# EAGLE design Solar Charge Controller (EAGLE 9.6.2)
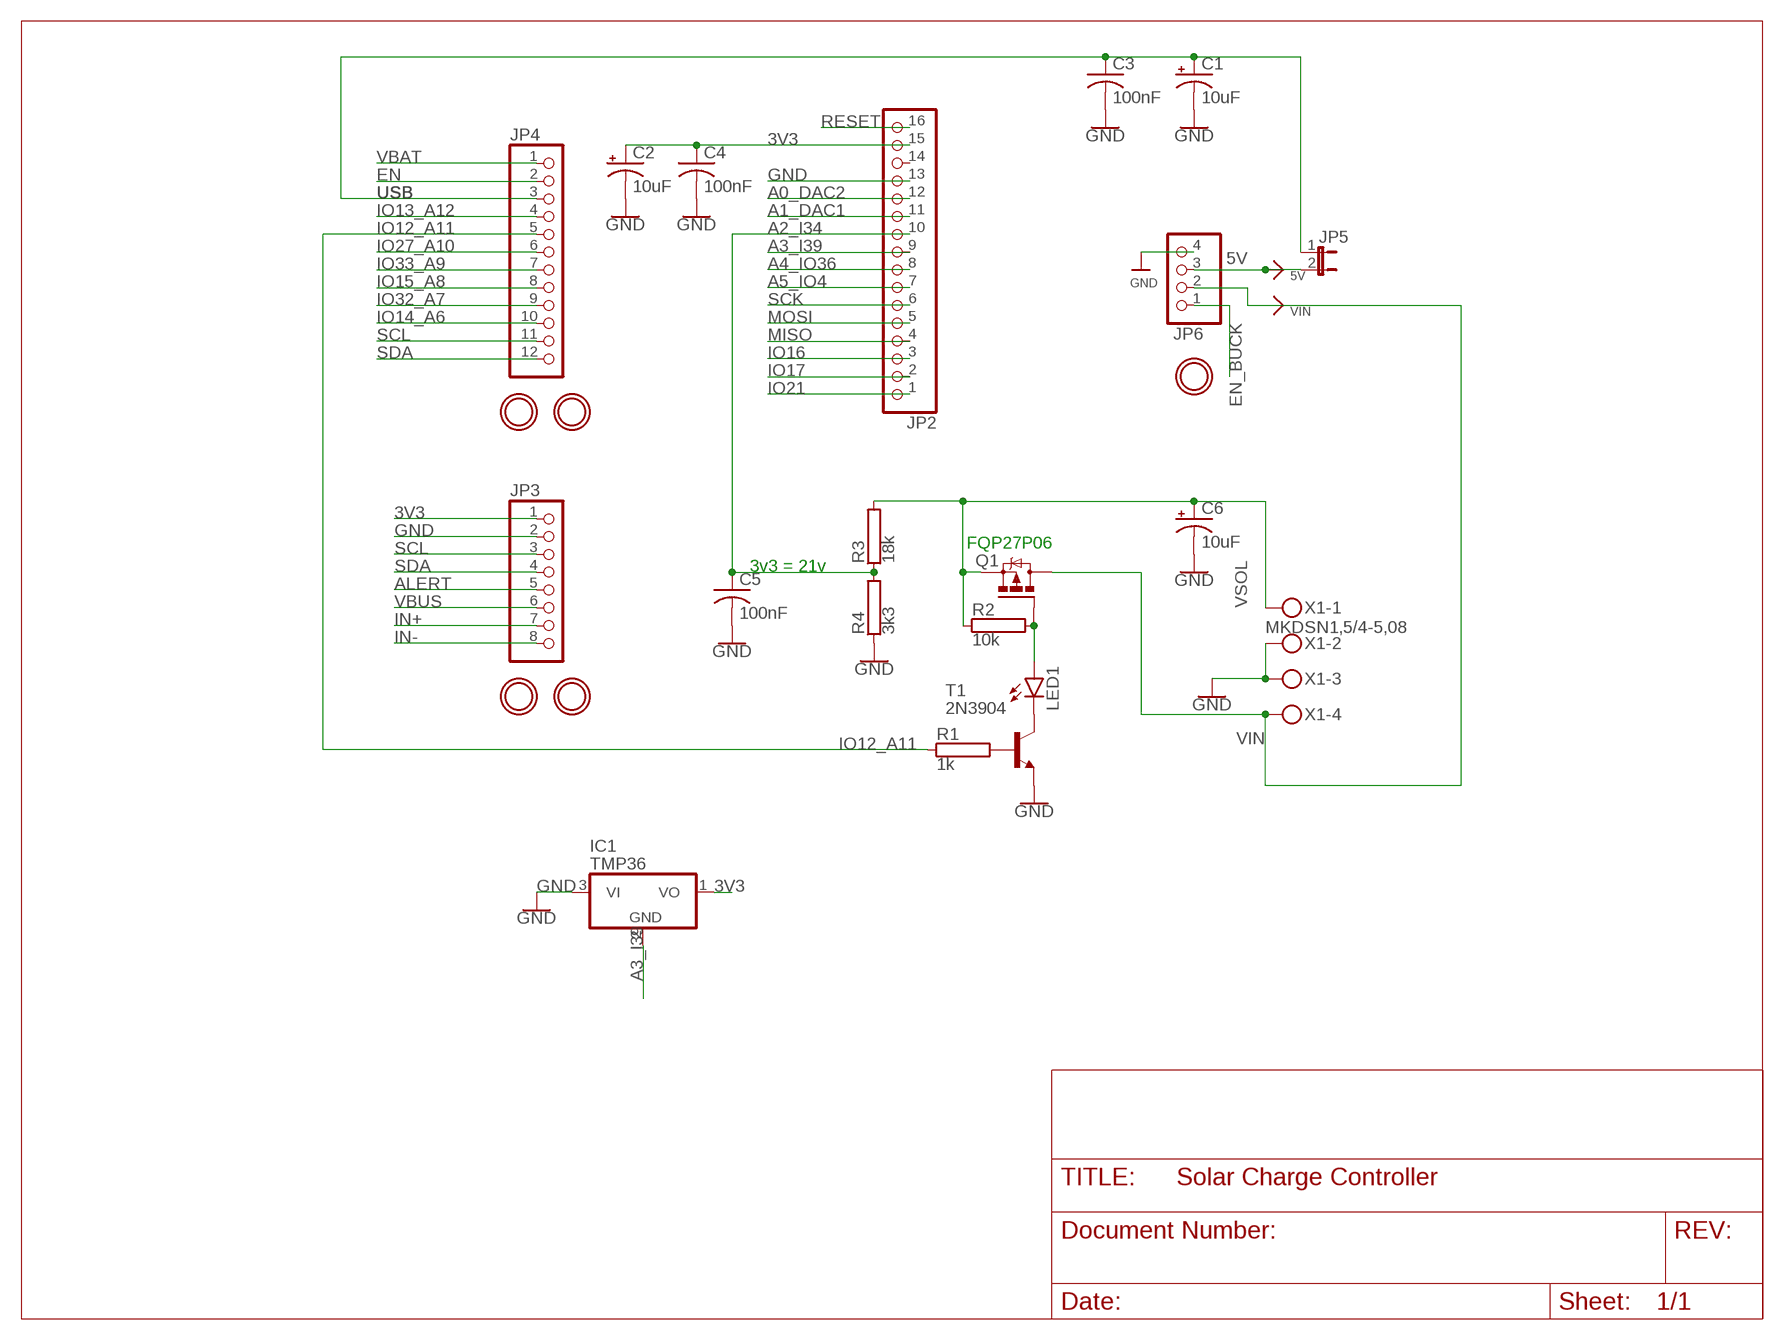
[diagram p0: schematic, sheet 1]

## Parts
C1  10uF  CPOL-USE2.5-5  [E2,5-5]
C2  10uF  CPOL-USE2.5-5  [E2,5-5]
C3  100nF  C-US025-024X044  [C025-024X044]
C4  100nF  C-US025-024X044  [C025-024X044]
C5  100nF  C-US025-024X044  [C025-024X044]
C6  10uF  CPOL-USE2.5-5  [E2,5-5]
IC1  TMP36  78L05Z  [TO92]
JP2  HEADER-1X16_MIN  [1X16_ROUND_MIN]
JP3  HEADER-1X870MIL  [1X08_ROUND_70]
JP4  HEADER-1X12_MIN  [1X12_ROUND_MIN]
JP5  JP1E  [JP1]
JP6  HEADER-1X4ROUND  [1X04_ROUND]
LED1  LED3MM  [LED3MM]
Q1  FQP27P06  IRF9530  [TO220BV]
R1  1k  RRS1/4  [RS1/4]
R2  10k  RRS1/4  [RS1/4]
R3  18k  RRS1/4  [RS1/4]
R4  3k3  RRS1/4  [RS1/4]
T1  2N3904  [TO92]
U$2  MOUNTINGHOLE2.5  [MOUNTINGHOLE_2.5_PLATED]
U$3  MOUNTINGHOLE2.5  [MOUNTINGHOLE_2.5_PLATED]
U$4  MOUNTINGHOLE2.5  [MOUNTINGHOLE_2.5_PLATED]
U$5  MOUNTINGHOLE2.5  [MOUNTINGHOLE_2.5_PLATED]
U$12  MOUNTINGHOLE2.5  [MOUNTINGHOLE_2.5_PLATED]
X1  MKDSN1,5/4-5,08  [MKDSN1,5/4-5,08]

## Nets
3V3: C2.+ C4.1 IC1.1(VO) JP2.15 JP3.1
5V: JP5.2 JP6.3
A0_DAC2: JP2.12
A1_DAC1: JP2.11
A2_I34: C5.1 JP2.10 R3.1 R4.2
A3_I39: IC1.2(GND) JP2.9
A4_IO36: JP2.8
A5_IO4: JP2.7
ALERT: JP3.5
EN: JP4.2
EN_BUCK: JP6.1
GND: C1.- C2.- C3.2 C4.2 C5.2 C6.- IC1.3(VI) JP2.13 JP3.2 JP6.4 R4.1 T1.3(E) X1.2 X1.3
IN+: JP3.7
IN-: JP3.8
IO12_A11: JP4.5 R1.1
IO13_A12: JP4.4
IO14_A6: JP4.10
IO15_A8: JP4.8
IO16: JP2.3
IO17: JP2.2
IO21: JP2.1
IO27_A10: JP4.6
IO32_A7: JP4.9
IO33_A9: JP4.7
MISO: JP2.4
MOSI: JP2.5
N$2: LED1.A Q1.G R2.2
N$3: LED1.K(C) T1.1(C)
N$4: R1.2 T1.2(B)
RESET: JP2.16
SCK: JP2.6
SCL: JP3.3 JP4.11
SDA: JP3.4 JP4.12
USB: C1.+ C3.1 JP4.3 JP5.1
VBAT: JP4.1
VBUS: JP3.6
VIN: JP6.2 Q1.D X1.4
VSOL: C6.+ Q1.S R2.1 R3.2 X1.1
Unconnected: JP2.14

## Notes on the sheet
- 3v3 = 21v

## Library data of the parts
C1 C2 C6 = rcl:CPOL-US: POLARIZED CAPACITOR, American symbol; SPICEPREFIX: C
C3-C5 = rcl:C-US: CAPACITOR, American symbol; SPICEPREFIX: C
IC1 = adafruit:78*: Positive VOLTAGE REGULATOR Added bigger pads to the TO-92 package
JP2 = microbuilder:HEADER-1X16: PIN HEADER
JP3 = microbuilder:HEADER-1X8: PIN HEADER
JP4 = microbuilder:HEADER-1X12
JP5 = jumper:JP1E: JUMPER
JP6 = microbuilder:HEADER-1X4: PIN HEADER
LED1 = led:LED: LED OSRAM: - CHIPLED LG R971, LG N971, LY N971, LG Q971, LY Q971, LO R971, LY R971 LH N974, LH R974 LS Q976, LO Q976, LY Q976 LO Q996 - Hyper CHIPLED LW Q18S LB Q993, LB Q99A, LB R99A - SideLED LS A670, LO A670, LY A670, LG A670, LP A670 LB A673, LV A673, LT A673, LW A673 LH A674 LY A675 LS A676, LA A676, LO A676, LY A676, LW A676 LS A679, LY A679, LG A679 - Hyper Micro SIDELED® LS Y876, LA Y876, LO Y876, LY Y876 LT Y87S - SmartLED LW L88C, LW L88S LB L89C, LB L89S, LG L890 LS L89K, LO L89K, LY L89K LS L896, LA L896, LO L896, LY L896 - TOPLED LS T670, LO T670, LY T670, LG T670, LP T670 LSG T670, LSP T670, LSY T670, LOP T670, LYG T670 LG T671, LOG T671, LSG T671 LB T673, LV T673, LT T673, LW T673 LH T674 LS T676, LA T676, LO T676, LY T676, LB T676, LH T676, LSB T676, LW T676 LB T67C, LV T67C, LT T67C, LS T67K, LO T67K, LY T67K, LW E67C LS E67B, LA E67B, LO E67B, LY E67B, LB E67C, LV E67C, LT E67C LW T67C LS T679, LY T679, LG T679 LS T770, LO T770, LY T770, LG T770, LP T770 LB T773, LV T773, LT T773, LW T773 LH T774 LS E675, LA E675, LY E675, LS T675 LS T776, LA T776, LO T776, LY T776, LB T776 LHGB T686 LT T68C, LB T68C - Hyper Mini TOPLED® LB M676 - Mini TOPLED Santana® LG M470 LS M47K, LO M47K, LY M47K Source: http://www.osram.convergy.de LUXEON: - LUMILED® LXK2-PW12-R00, LXK2-PW12-S00, LXK2-PW14-U00, LXK2-PW14-V00 LXK2-PM12-R00, LXK2-PM12-S00, LXK2-PM14-U00 LXK2-PE12-Q00, LXK2-PE12-R00, LXK2-PE12-S00, LXK2-PE14-T00, LXK2-PE14-U00 LXK2-PB12-K00, LXK2-PB12-L00, LXK2-PB12-M00, LXK2-PB14-N00, LXK2-PB14-P00, LXK2-PB14-Q00 LXK2-PR12-L00, LXK2-PR12-M00, LXK2-PR14-Q00, LXK2-PR14-R00 LXK2-PD12-Q00, LXK2-PD12-R00, LXK2-PD12-S00 LXK2-PH12-R00, LXK2-PH12-S00 LXK2-PL12-P00, LXK2-PL12-Q00, LXK2-PL12-R00 Source: www.luxeon.com KINGBRIGHT: KA-3528ASYC Source: www.kingbright.com
Q1 = transistor-power:IRF9530: P-CHANNEL HEXFET POWER-MOS-FET Source: http://www.irf.com/product-info/datasheets/data/irf9530.pdf
R1-R4 = resistor-power:R: Power Resitor; MF: OHMITE; MPN: RRS1K0; OC_FARNELL: unknown; OC_NEWARK: 01F7661
T1 = transistor:2N3904: NPN TRANSISTOR
U$2-U$5 U$12 = microbuilder:MOUNTINGHOLE: Mounting Hole For #2 screws (0.086"/2.18mm width, 0.094"/2.4mm hole) use 2.5mm; BOM: EXCLUDE
X1 = con-phoenix-508:MKDSN1,5/4-5,08: MKDSN 1,5/ 4-5,08 Printklemme Nennstrom: 13,5 A Nennspannung: 250 V Rastermaß: 5,08 mm Polzahl: 4 Anschlussart: Schraubanschluss Montage: Löten Anschlussrichtung Leiter/Platine: 0 ° Artikelnummer: 1729144 Source: http://eshop.phoenixcontact.com .. 1729144.pdf

## Board
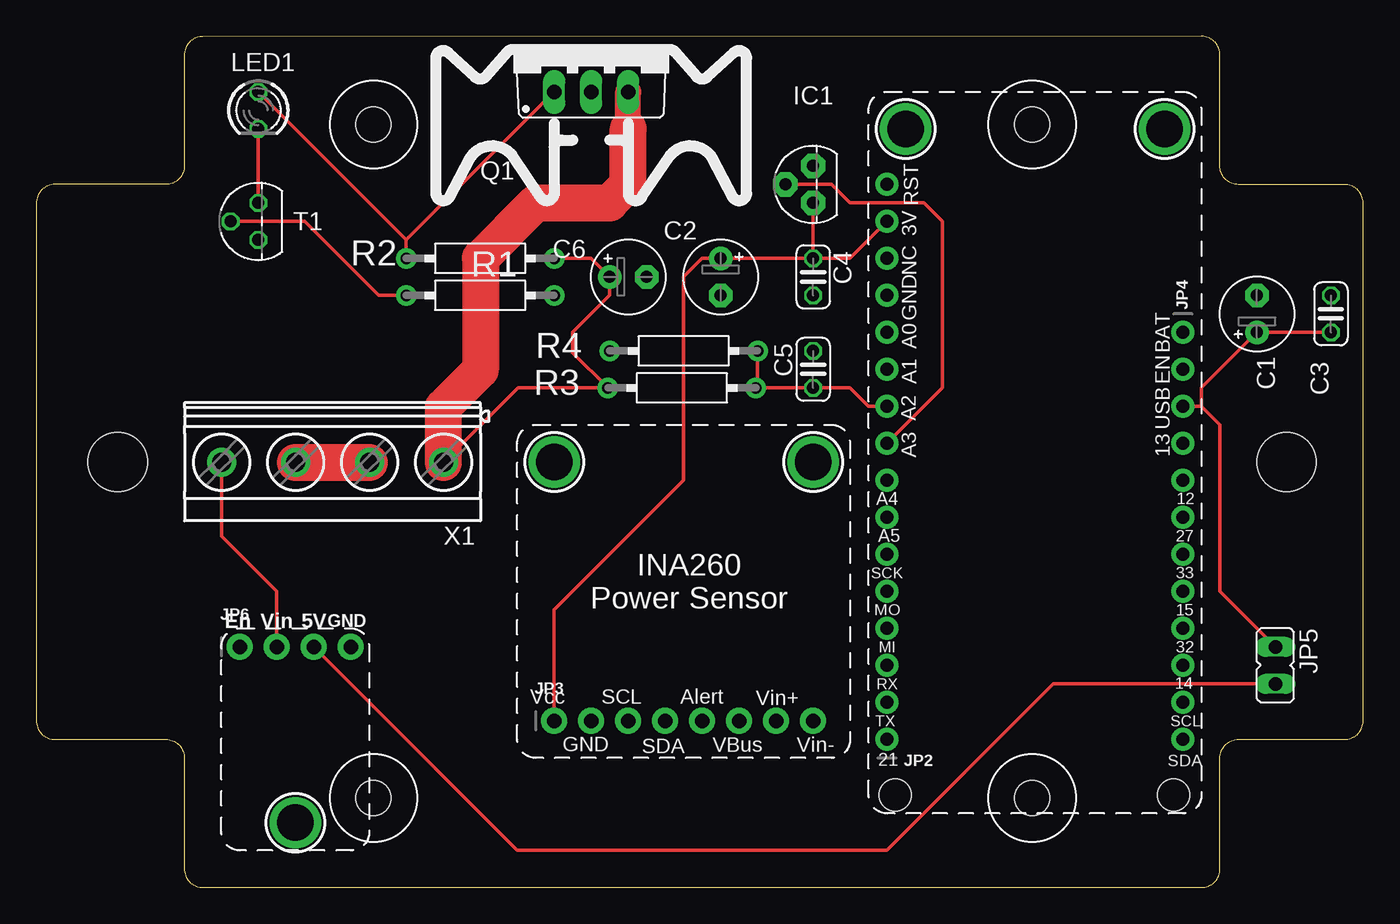
[diagram p1: board, top side]
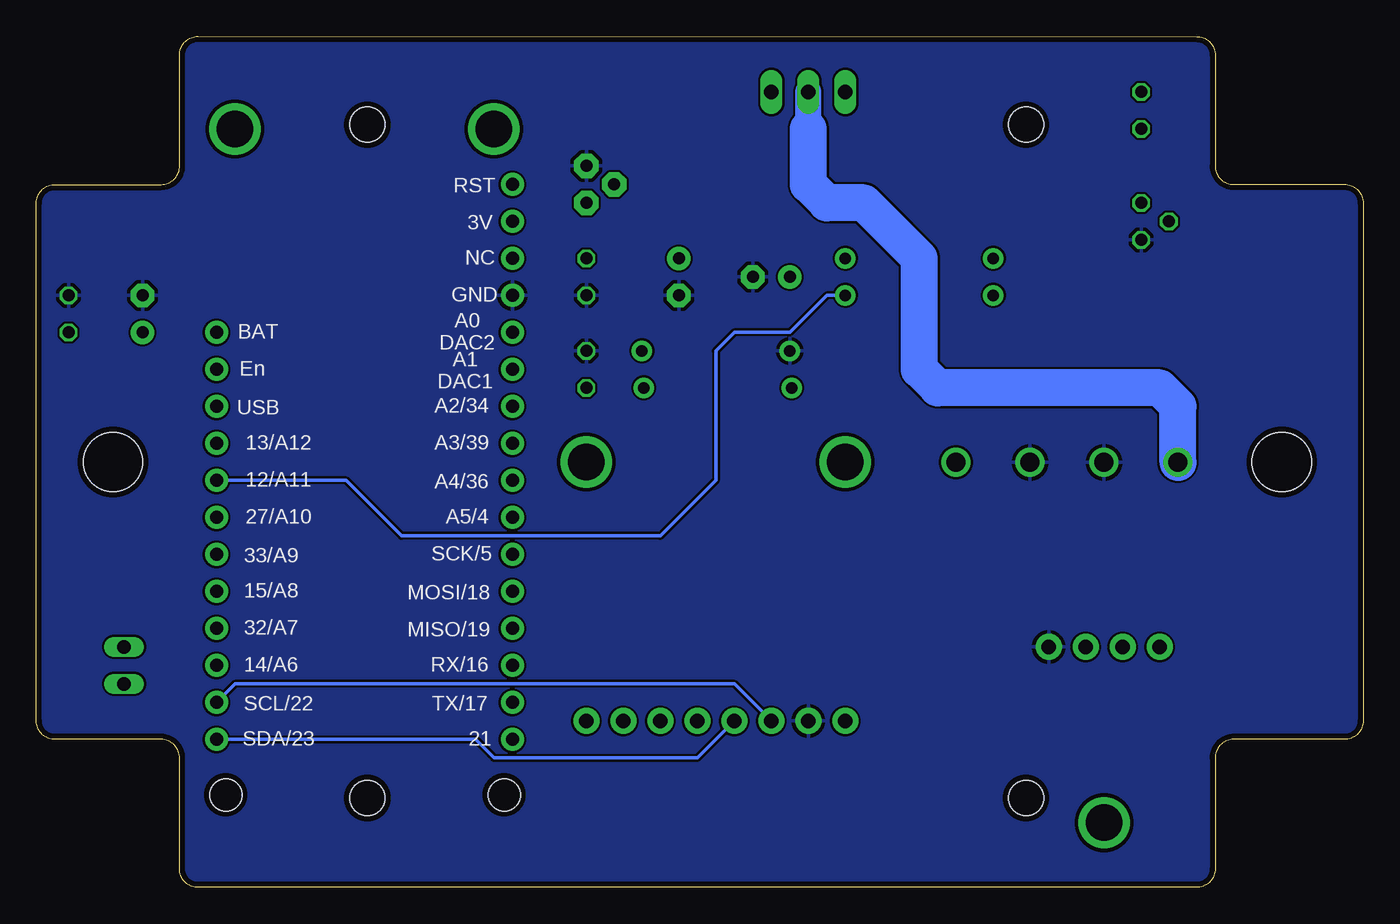
[diagram p2: board, bottom side, seen from below]

Size 91.11 x 58.42 mm. Coordinates in mm from the lower left corner, seen from the top.
Outline: 11.43,0 80.01,0 arc90 81.28,1.27 81.28,8.89 arc-90 82.55,10.16 89.84,10.16 arc90 91.11,11.43 91.11,46.98 arc90 89.84,48.25 82.54,48.25 arc-90 81.27,49.52 81.28,57.15 arc90 80.01,58.42 11.43,58.41 arc90 10.16,57.14 10.16,49.53 arc-90 8.89,48.26 1.27,48.26 arc90 0,46.99 0,11.43 arc90 1.27,10.16 8.89,10.16 arc-90 10.16,8.89 10.16,1.27 arc90 11.43,0
Copper layers (1*16): Top 0.035559375mm / dielectric 1.6mm / Bottom 0.035559375mm
Design rules "oshpark-2layer": minimum track width 6mil, minimum drill 10mil, track to track 6mil, track to pad 6mil, pad to pad 6mil, via to via 6mil, smd to smd 6mil, copper to edge 15mil, drill to drill 6mil, minimum pad ring 5mil, minimum via ring 5mil, stop-mask expansion 2.5mil, vias tented up to drill 0mil, thermal gap 10mil
Holes 2.2 mm at 58.99,6.35 78.11,6.35
Holes 4.06 mm at 5.59,29.21 85.85,29.21

### Footprints (pad centres in the part's own frame; a part is rotated, then mirrored left to right if it is on the bottom)
E2,5-5 = drill 0.813 pad 1.6: + -1.27,0 | drill 0.813 pad 1.6 octagon: - 1.27,0
C025-024X044 = drill 0.813 octagon: 1 -1.27,0; 2 1.27,0
ENCLOSURE_MOUNTING = hole 2.4: -22.615,23.115; -22.615,-23.115; 22.615,23.115; 22.615,-23.115
TO92 = drill 0.813 pad 1.676 octagon: 1 -1.27,0; 2 0,1.905; 3 1.27,0
1X16_ROUND_MIN = drill 0.9 pad 1.575: 1 -19.05,0; 2 -16.51,0; 3 -13.97,0; 4 -11.43,0; 5 -8.89,0; 6 -6.35,0; 7 -3.81,0; 8 -1.27,0; 9 1.27,0; 10 3.81,0; 11 6.35,0; 12 8.89,0; 13 11.43,0; 14 13.97,0; 15 16.51,0; 16 19.05,0
1X08_ROUND_70 = drill 1 pad 1.778: 1 -8.89,0; 2 -6.35,0; 3 -3.81,0; 4 -1.27,0; 5 1.27,0; 6 3.81,0; 7 6.35,0; 8 8.89,0
1X12_ROUND_MIN = drill 0.9 pad 1.575: 1 -13.97,0; 2 -11.43,0; 3 -8.89,0; 4 -6.35,0; 5 -3.81,0; 6 -1.27,0; 7 1.27,0; 8 3.81,0; 9 6.35,0; 10 8.89,0; 11 11.43,0; 12 13.97,0
JP1 = drill 0.914 long: 1 0,-1.27; 2 0,1.27
1X04_ROUND = drill 1 pad 1.778: 1 -3.81,0; 2 -1.27,0; 3 1.27,0; 4 3.81,0
LED3MM = drill 0.813 octagon: A -1.27,0; K 1.27,0
TO220BV = drill 1.016 long: D 0,-2.54; G -2.54,-2.54; S 2.54,-2.54
RS1/4 = drill 0.8 pad 1.4: 1 -5.08,0; 2 5.08,0
TO92' = drill 0.813 octagon: 1 1.27,0; 2 0,1.905; 3 -1.27,0
MOUNTINGHOLE_2.5_PLATED = drill 2.5 pad 3.2: P$1 0,0
MKDSN1,5/4-5,08 = drill 1.3 pad 2: 1 -7.641,0.025; 2 -2.561,0.025; 3 2.519,0.025; 4 7.599,0.025

### Placement (x,y rotation side)
C1  83.82,39.37 90 top
C2  46.99,41.91 270 top
C3  88.9,39.37 90 top
C4  53.34,41.91 270 top
C5  53.34,35.56 90 top
C6  40.64,41.91 0 top
E$1  [ENCLOSURE_MOUNTING]  45.77,29.25 0 top
IC1  53.34,48.26 90 top
JP2  58.42,29.21 90 top
JP3  44.45,11.43 0 top
JP4  78.74,24.13 270 top
JP5  85.09,15.24 180 top
JP6  17.78,16.51 0 top
LED1  15.24,53.34 270 top
Q1  38.1,57.15 0 top
R1  30.48,40.64 180 top
R2  30.48,43.18 180 top
R3  44.32,34.29 180 top
R4  44.45,36.83 0 top
T1  2N3904  [TO92']  15.24,45.72 90 top
U$1  [PF752]  38.1,57.15 0 top
U$2  77.47,52.07 180 top
U$3  59.69,52.07 180 top
U$4  53.34,29.21 0 top
U$5  35.56,29.21 0 top
U$12  17.78,4.45 180 top
X1  20.32,29.21 180 top

### Tracks (layer width: path | path; a pad name or v marks a point on that pad's centre or on a via)
3V3
  Top 0.254: C4.1 C2.+ 45.72,43.18 44.45,41.91 44.45,27.94 35.56,19.05 JP3.1 | C4.1 55.88,43.18 JP2.15 | IC1.1 C4.1
5V
  Top 0.254: JP6.3 33.02,2.54 58.42,2.54 69.85,13.97 JP5.2
A2_I34
  Top 0.254: R4.2 49.53,34.42 R3.1 C5.1 55.88,34.29 57.15,33.02 JP2.10
A3_I39
  Top 0.254: JP2.9 62.23,34.29 62.23,45.72 60.96,46.99 55.88,46.99 54.61,48.26 IC1.2
GND
  Top 2.54: X1.3 X1.2
  pour Bottom: -1.27,-1.27 -1.27,57.15 1.27,59.69 91.44,59.69 93.98,57.15 93.98,-1.27
IO12_A11
  Bottom 0.254: R1.1 36.83,40.64 39.37,38.1 43.18,38.1 44.45,36.83 44.45,27.94 48.26,24.13 66.04,24.13 69.85,27.94 JP4.5
N$2
  Top 0.254: Q1.G 25.4,44.45 | 25.4,44.45 R2.2 | LED1.A 25.4,44.45
N$3
  Top 0.254: LED1.K T1.1
N$4
  Top 0.254: R1.2 23.5,40.64 18.41,45.72 T1.2
SCL
  Bottom 0.254: JP3.3 43.18,13.97 77.47,13.97 JP4.11
SDA
  Bottom 0.254: JP4.12 60.96,10.16 59.69,8.89 45.72,8.89 JP3.4
USB
  Top 0.254: JP4.3 80.01,33.02 | 80.01,33.02 81.28,31.75 81.28,20.32 JP5.1 | C3.1 C1.+ 80.01,34.29 80.01,33.02
VIN
  Top 0.254: X1.4 12.72,24.11 16.51,20.32 JP6.2
  Bottom 1.778: 38.1,52.07 Q1.D
  Bottom 2.54: X1.4 12.72,33 12.7,33.02 13.97,34.29 29.21,34.29 30.48,35.56 30.48,43.18 34.29,46.99 36.83,46.99 38.1,48.26 38.1,52.07
VSOL
  Top 0.254: X1.1 33.07,34.29 R3.2 36.83,36.7 36.83,38.1 39.37,40.64 C6.+ 38.1,43.18 R2.1
  Top 1.778: 40.64,52.07 Q1.S
  Top 2.54: X1.1 27.96,32.99 30.5,35.53 30.5,43.2 34.29,46.99 39.37,46.99 40.64,48.26 40.64,52.07

### Text on the board
tPlace: RST | 3V | NC | GND | A0 | BAT | EN | A1 | A2 | USB | A3 | 13 | A4 | 12 | A5 | 27 | SCK | 33 | INA260 / Power Sensor | MO | 15 | En | Vin | 5V | GND | MI | 32 | Vcc | SCL | Alert | Vin+ | RX | 14 | TX | SCL | GND | SDA | VBus | Vin- | 21 | SDA
bPlace: RST | 3V | NC | GND | A0 / DAC2 | BAT | En | A1 / DAC1 | A2/34 | USB | A3/39 | 13/A12 | A4/36 | 12/A11 | A5/4 | 27/A10 | SCK/5 | 33/A9 | MOSI/18 | 15/A8 | MISO/19 | 32/A7 | RX/16 | 14/A6 | TX/17 | SCL/22 | 21 | SDA/23